# Altium schematic sheet SMPS.SchDoc
size A4; DocumentNumber: 1; SheetNumber: 7; SheetTotal: 7
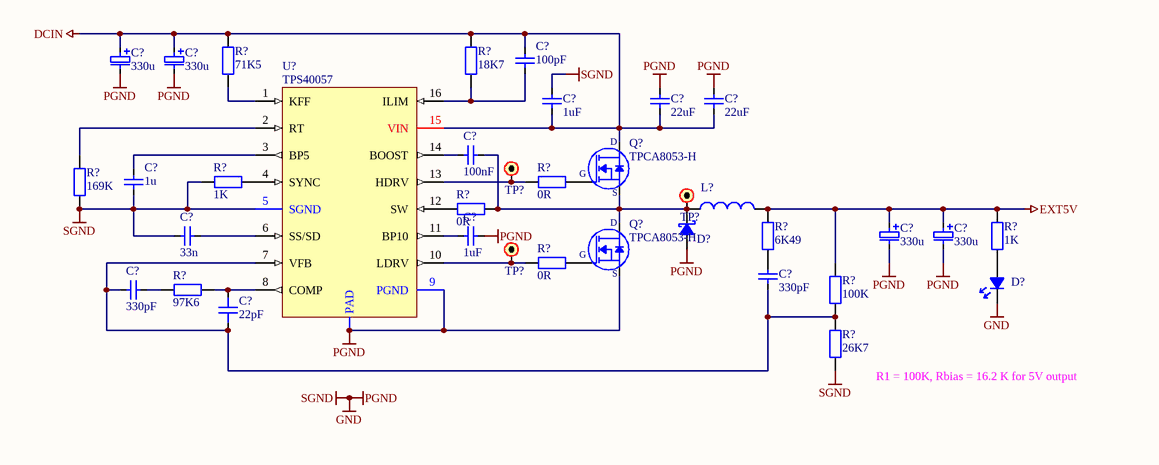
[diagram p0: SMPS.SchDoc]

## Parts
(Parts that share a designator on the sheet are numbered #1, #2 ... from top to bottom, then left to right.)
C?#1  330u  [C_EL_B_4MM_RF_M]
C?#2  330u  [C_EL_B_4MM_RF_M]
C?#3  100pF  [0805C_RF_M]
C?#4  1uF  [0805C_RF_M]
C?#5  22uF  [0805C_RF_M]
C?#6  22uF  [0805C_RF_M]
C?#7  100nF  [0805C_RF_M]
C?#8  1u  [0805C_RF_M]
C?#9  33n  [0805C_RF_M]
C?#10  1uF  [0805C_RF_M]
C?#11  330u  [C_EL_B_4MM_RF_M]
C?#12  330u  [C_EL_B_4MM_RF_M]
C?#13  330pF  [0805C_RF_M]
C?#14  330pF  [0805C_RF_M]
C?#15  22pF  [0805C_RF_M]
D?#1  Schottky  [ONSEMI_DO214AB_RF_M]  (value not drawn)
D?#2  LED  [0805LED_RF_M]  (value not drawn)
L?  6.1 uH  [CDEP147]  (value not drawn)
Q?#1  TPCA8053-H  [DFN-8]
Q?#2  TPCA8053-H  [DFN-8]
R?#1  71K5  [0805R_RF_M]
R?#2  18K7  [0805R_RF_M]
R?#3  1K  [0805R_RF_M]
R?#4  0R  [0805R_RF_M]
R?#5  169K  [0805R_RF_M]
R?#6  0R  [0805R_RF_M]
R?#7  6K49  [0805R_RF_M]
R?#8  0R  [0805R_RF_M]
R?#9  100K  [0805R_RF_M]
R?#10  1K  [0603R_RF_M]
R?#11  97K6  [0805R_RF_M]
R?#12  26K7  [0805R_RF_M]
TP?#1  Test Point  [PAD_R_1.5MM]  (value not drawn)
TP?#2  Test Point  [PAD_R_1.5MM]  (value not drawn)
TP?#3  Test Point  [PAD_R_1.5MM]  (value not drawn)
U?  TPS40057  [TI_HTSSOP-16]

## Nets
DCIN: C?#1.P C?#2.P C?#3.2 C?#4.2 C?#5.2 C?#6.2 Q?#1.3(D) R?#1.2 R?#2.2 U?.15(VIN)
EXT5V: C?#11.P C?#12.P L?.2 R?#7.1 R?#9.1 R?#10.2
GND: C?#1.N C?#2.N C?#4.1 C?#5.1 C?#6.1 C?#8.1 C?#9.1 C?#10.1 C?#11.N C?#12.N D?#1.A D?#2.C Q?#2.2(S) R?#3.1 R?#5.1 R?#12.2 U?.5(SGND) U?.9(PGND) U?.PAD  [also labelled PGND, SGND]
NetC?#3_1: C?#3.1 R?#2.1 U?.16(ILIM)
NetC?#7_1: C?#7.1 D?#1.C L?.1 Q?#1.2(S) Q?#2.3(D) R?#6.2 TP?#2.1
NetC?#7_2: C?#7.2 U?.14(BOOST)
NetC?#8_2: C?#8.2 U?.3(BP5)
NetC?#9_2: C?#9.2 U?.6(SS/SD)
NetC?#10_2: C?#10.2 U?.11(BP10)
NetC?#13_1: C?#13.1 R?#7.2
NetC?#13_2: C?#13.2 C?#14.1 C?#15.2 R?#9.2 R?#12.1 U?.7(VFB)
NetC?#14_2: C?#14.2 R?#11.1
NetC?#15_1: C?#15.1 R?#11.2 U?.8(COMP)
NetD?#2_A: D?#2.A R?#10.1
NetQ?#1_1: Q?#1.1(G) R?#4.2
NetQ?#2_1: Q?#2.1(G) R?#8.2
NetR?#1_1: R?#1.1 U?.1(KFF)
NetR?#3_2: R?#3.2 U?.4(SYNC)
NetR?#4_1: R?#4.1 TP?#1.1 U?.13(HDRV)
NetR?#5_2: R?#5.2 U?.2(RT)
NetR?#6_1: R?#6.1 U?.12(SW)
NetR?#8_1: R?#8.1 TP?#3.1 U?.10(LDRV)

## Notes on the sheet
- (near R?#12) R1 = 100K, Rbias = 16.2 K for 5V output
- Author
- Date
- Revision
- Size
- A4
- Sheet
- of

## Library data of the parts
C?#1 C?#2 C?#11 C?#12 = C-P: Polarized Capacitor; Manufacturer: Generic Brand; Max Voltage: ? V; Value: 330u; Mounting Technology: SMT; Tolerance: ?; Tag: *; Manufacturer Part No: *; Supplier: *; Supplier Link: http://; Supplier Part No: *; Category: Capacitor
C?#3-C?#10 C?#13-C?#15 = C: Capacitor; Manufacturer: Generic Brand; Max Voltage: ? V; Tolerance: ?; Mounting Technology: SMT; Tag: *; Manufacturer Part No: *; Supplier: *; Supplier Link: http://; Supplier Part No: *; Category: Capacitor
  C?#3: Value: 100pF
  C?#4 C?#10: Value: 1uF
  C?#5 C?#6: Value: 22uF
  C?#7: Value: 100nF
  C?#8: Value: 1u
  C?#9: Value: 33n
  C?#13 C?#14: Value: 330pF
  C?#15: Value: 22pF
D?#1 = D-SCHOTTKY: Schottky Diode; Manufacturer: Generic Brand; Max Forward Voltage: ? V; Power Rating: ? W; Manufacturer Part No: *; Supplier: *; Supplier Link: http://; Supplier Part No: *; Mounting Technology: SMT; Category: Diode
D?#2 = LED: Manufacturer: Generic Brand; Emitting Color: Unspecified; Forward Voltage Drop: ? V; Manufacturer Part No: *; Supplier: *; Supplier Link: http://; Supplier Part No: *; Mounting Technology: SMT; Category: Diode
L? = CDEP147NP-6R1MC-125: FIXED IND 6.1UH 12.5A 6.03 MOHM; Manufacturer: Sumida America Components Inc.; Value: 6.1 uH; Mounting Technology: SMT; Category: Inductor; Product Number: CDEP147NP-6R1MC-125; Supplier Part No: CDEP147NP-6R1MC-125-ND; Supplier Link: https://www.digikey.com/en/products/detail/sumida-america-components-inc/CDEP147NP-6R1MC-125/4038408; Supplier: DigiKey; Package: Non-Standard
Q?#1 Q?#2 = TPCA8053-H: MOSFET N-CH 60V 15A; Manufacturer: Toshiba; Manufacturer Part No: *; Supplier: *; Supplier Link: *; Supplier Part No: *; Mounting Technology: SMT; Package: SO-8FL; Alternative Supplier: *; Alternative Supplier Part No: *; Alternative Supplier Link: *; Datasheet Link: http://www.farnell.com/datasheets/1339268.pdf
R?#1-R?#9 R?#11 R?#12 = R: Resistor; Manufacturer: Generic Brand; Power Rating: ? W; Max Voltage: ? V; Tolerance: ?; Supplier Link: http://; Category: Resistor; Mounting Technology: SMT
  R?#1: Value: 71K5
  R?#2: Value: 18K7
  R?#3: Value: 1K
  R?#4 R?#6 R?#8: Value: 0R
  R?#5: Value: 169K
  R?#7: Value: 6K49
  R?#9: Value: 100K
  R?#11: Value: 97K6
  R?#12: Value: 26K7
R?#10 = R: Resistor; Manufacturer: Generic Brand; Max Voltage: ? V; Power Rating: ? W; Value: 1K; Tolerance: ?; Manufacturer Part No: *; Supplier: *; Supplier Link: http://; Supplier Part No: *; Category: Resistor; Mounting Technology: SMT
TP?#1-TP?#3 = Test Point: Test Point / Pad
U? = TPS40057: IC REG CTRLR BUCK 16HTSSOP; Manufacturer: Texas Instruments; Product Number: TPS40057PWPR; Mounting Technology: SMT; Supplier Link: https://www.digikey.com/en/products/detail/texas-instruments/TPS40057PWPR/1671697; Supplier: DigiKey; Supplier Part No: 296-26961-1-ND; Package: HTSSOP-16